# Altium schematic sheet Power1.SchDoc: Titel
size A3; ApprovedBy: name; CompanyName: DCI Electronics bv; DrawnBy: KRS; Address1: Nijverheidsstraat 14; Address2: 4458 AV Eindewege; Address3: Phone: +31 (0)113 344880; DocumentNumber: 6; Revision: 2; SheetNumber: 6; SheetTotal: 14; PageSetup: Record=PageOptions|CenterHorizontal=True|CenterVertical=True|PrintScale=1.00|XCorrection=1.00|YCorrection=1.00|PrintKind=1|BorderSize=5000000|LeftOffset=0|BottomOffset=0|Orientation=2|PaperLength=1000|PaperWidth=1000|Scale=100|PaperSource=7|PrintQuality=-4|MediaType=1|DitherType=10|PaperKind=ISO_A4_(210.00_x_297.00_MM)|PrintScaleMode=1; SubTitle: SubTitel; ApprovedDate: 01-01-12
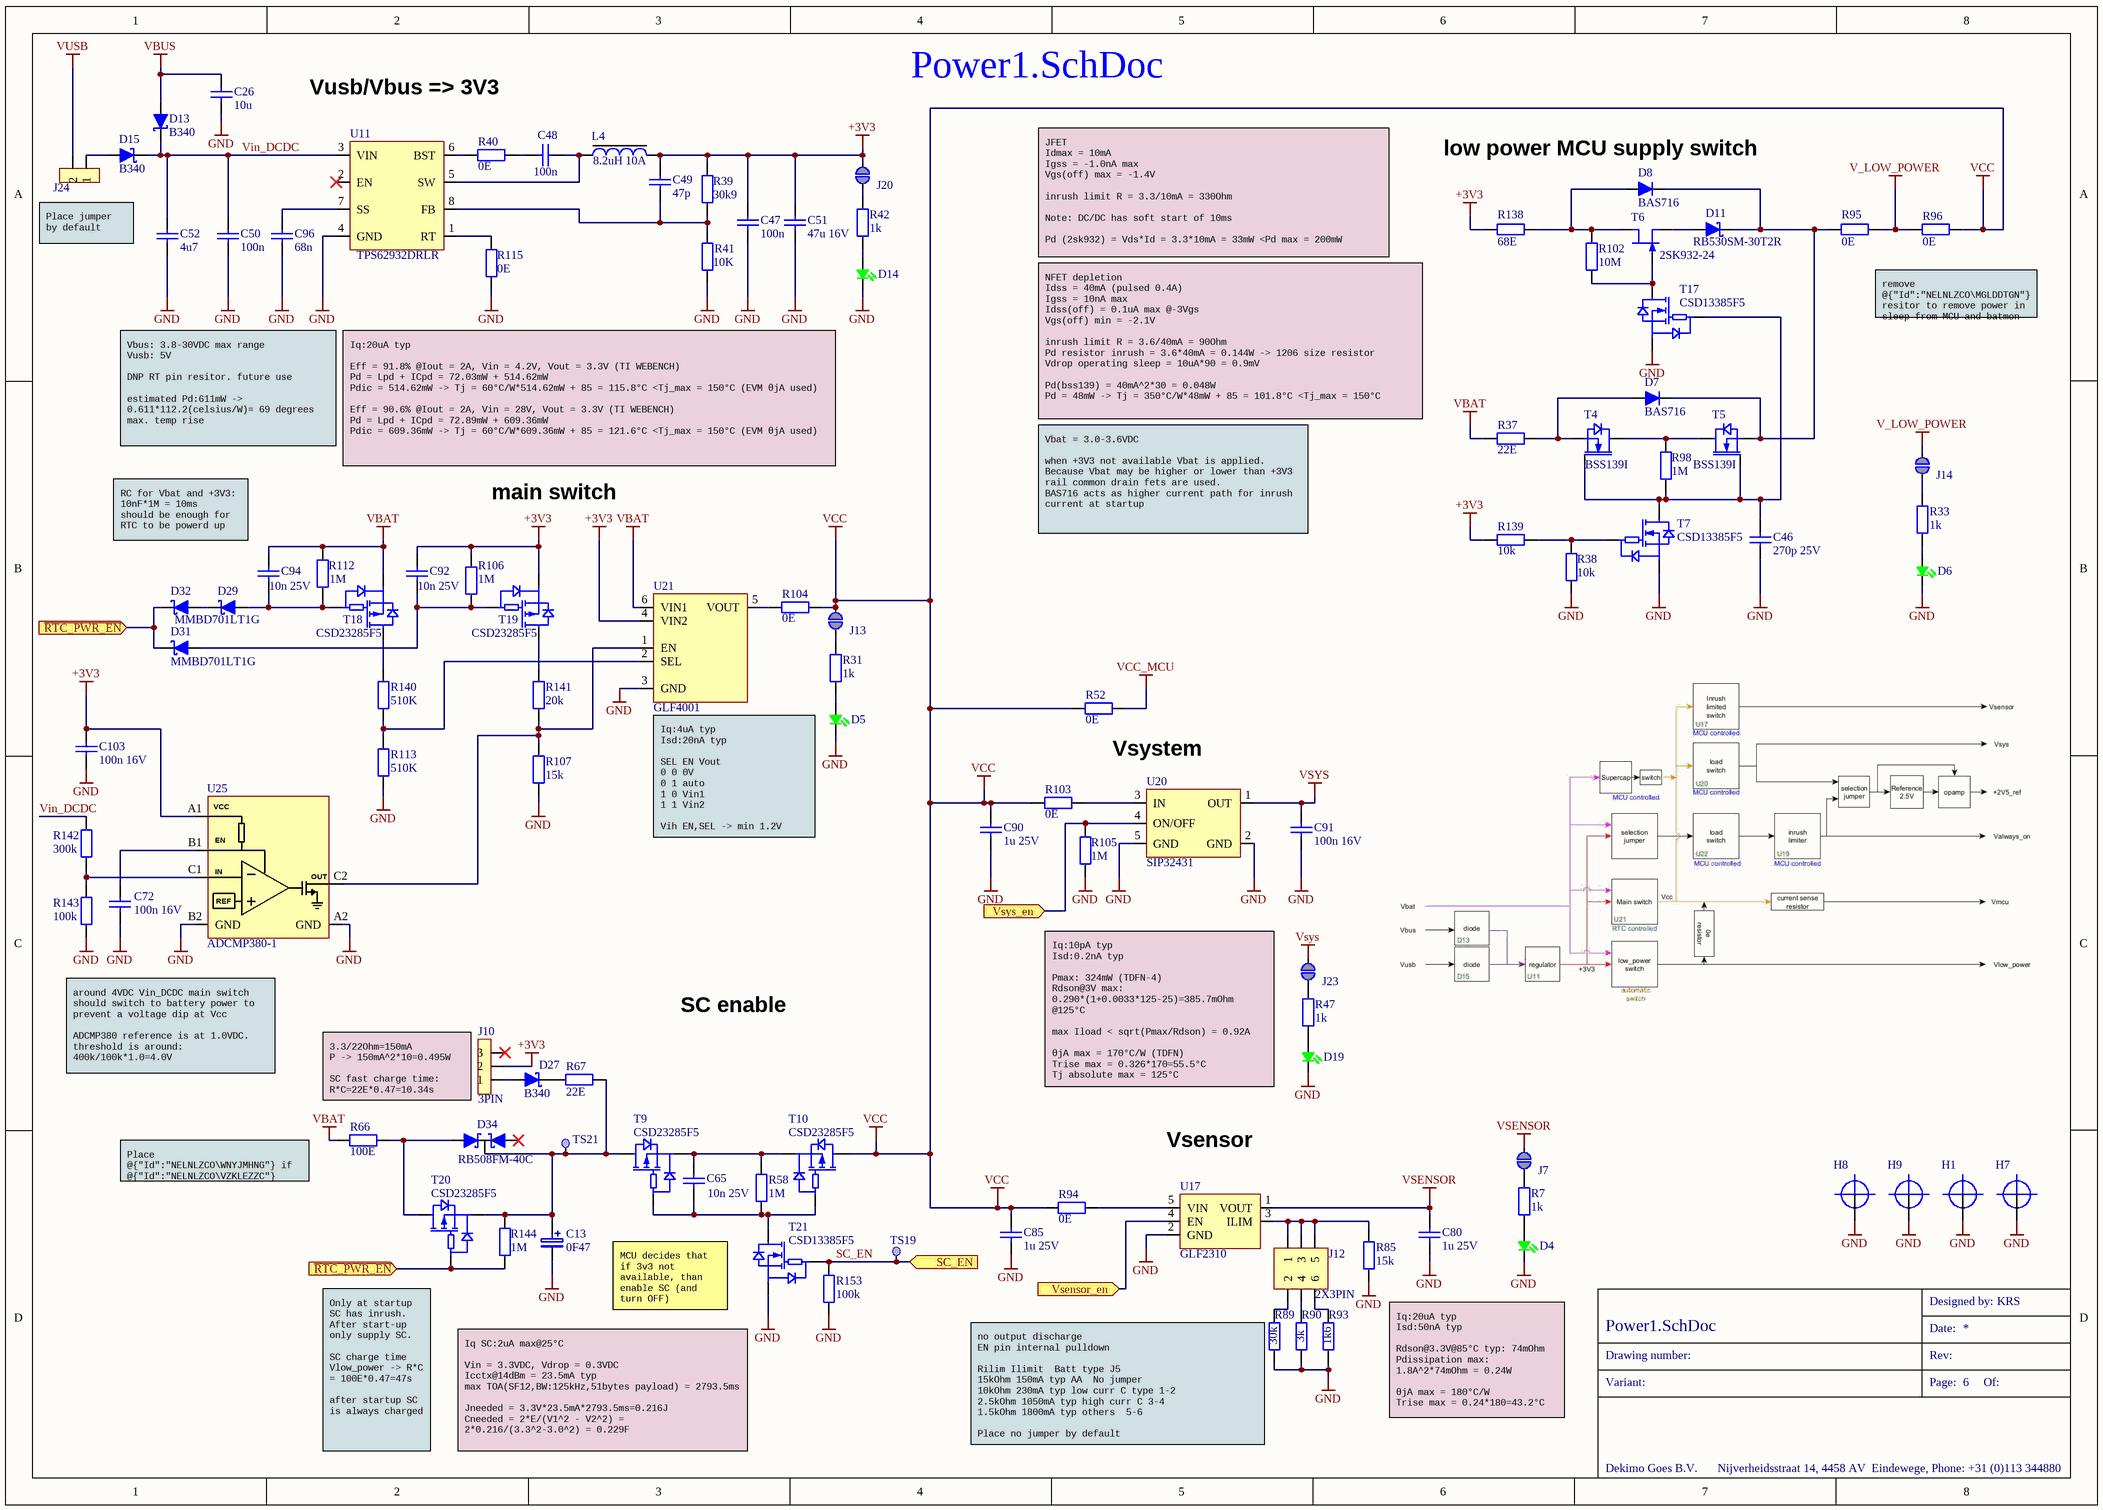
[diagram p0: Power1.SchDoc]

## Parts
C13  0F47  [CAP-003G000-002]
C26  10u  [CAPC3216X18N]
C46  270p 25V  [CAPC1005X05N]
C47  100n  [CAPC1608X09N]
C48  100n  [CAPC1608X09N]
C49  47p  [CAPC1608X09N]
C50  100n  [CAPC1608X09N]
C51  47u 16V  [CAPC3225X27N]
C52  4u7  [CAPC3216X13N]
C65  10n 25V  [CAPC1005X05N]
C72  100n 16V  [CAPC1005X05N]
C80  1u 25V  [CAPC1608X09N]
C85  1u 25V  [CAPC1608X09N]
C90  1u 25V  [CAPC1608X09N]
C91  100n 16V  [CAPC1005X05N]
C92  10n 25V  [CAPC1005X05N]
C94  10n 25V  [CAPC1005X05N]
C96  68n  [CAPC2013X14N]
C103  100n 16V  [CAPC1005X05N]
D4  (no value)  [LED_0603_ANODE]
D5  (no value)  [LED_0603_ANODE]
D6  (no value)  [LED_0603_ANODE]
D7  BAS716  [SODFL16080X62N]
D8  BAS716  [SODFL16080X62N]
D11  RB530SM-30T2R  [SODFL16080X62N]
D13  B340  [DIO-001001-002]
D14  (no value)  [LED_0603_ANODE]
D15  B340  [DIO-001001-002]
D19  (no value)  [LED_0603_ANODE]
D27  B340  [DIO-001001-002]
D29  MMBD701LT1G  [SOT95P245X110-3N]
D31  MMBD701LT1G  [SOT95P245X110-3N]
D32  MMBD701LT1G  [SOT95P245X110-3N]  (value not drawn)
D34  RB508FM-40C  [SOT-650G001-003]
H1  HOLE_PTH  [PTH_0.8_1.5]  (value not drawn)  (no BOM)
H7  HOLE_PTH  [PTH_0.8_1.5]  (value not drawn)  (no BOM)
H8  HOLE_PTH  [PTH_0.8_1.5]  (value not drawn)  (no BOM)
H9  HOLE_PTH  [PTH_0.8_1.5]  (value not drawn)  (no BOM)
J7  Solderbridge - Normally Open  [Solderbridge NO]  (value not drawn)  (no BOM)
J10  3PIN  [CON-003G000-003]
J12  2X3PIN  [CON-003G000-006]
J13  Solderbridge - Normally Open  [Solderbridge NO]  (value not drawn)  (no BOM)
J14  Solderbridge - Normally Open  [Solderbridge NO]  (value not drawn)  (no BOM)
J20  Solderbridge - Normally Open  [Solderbridge NO]  (value not drawn)  (no BOM)
J23  Solderbridge - Normally Open  [Solderbridge NO]  (value not drawn)  (no BOM)
J24  2PIN  [PHDR1X2_P2.54]  (value not drawn)
L4  8.2uH 10A  [IND-001G001-002]
R7  1k  [RESC1608X13N]
R31  1k  [RESC1608X13N]
R33  1k  [RESC1608X13N]
R37  22E  [RESC1608X13N]
R38  10k  [RESC1005X04N]
R39  30k9  [RESC2013X14N]
R40  0E  [RESC1608X13N]
R41  10K  [RESC1608X13N]
R42  1k  [RESC1608X13N]
R47  1k  [RESC1608X13N]
R52  0E  [RESC3116X13N]
R58  1M  [RESC1005x04N]
R66  100E  [RESC3116X13N]
R67  22E  [RESC2013X14N]
R85  15k  [RESC1608X13N]
R89  30k  [RESC1608X13N]
R90  3k  [RESC1608X13N]
R93  1k6  [RESC1608X13N]
R94  0E  [RESC1608X13N]
R95  0E  [RESC3116X13N]
R96  0E  [RESC2013X14N]
R98  1M  [RESC1608X13N]
R102  10M  [RESC1608X13N]
R103  0E  [RESC1608X13N]
R104  0E  [RESC2013X14N]
R105  1M  [RESC1005x04N]
R106  1M  [RESC1005x04N]
R107  15k  [RESC1608X13N]
R112  1M  [RESC1005x04N]
R113  510K  [RESC1005X04N]
R115  0E  [RESC1608X13N]
R138  68E  [RESC2013X14N]
R139  10k  [RESC1005X04N]
R140  510K  [RESC1005X04N]
R141  20k  [RESC1005X04N]
R142  300k  [RESC1005X04N]
R143  100k  [RESC1005X04N]
R144  1M  [RESC1005x04N]
R153  100k  [RESC1005X04N]
T4  BSS139I  [SOT95P245X110_GSD-3N]
T5  BSS139I  [SOT95P245X110_GSD-3N]
T6  2SK932-24  [SOT-950G000-003]
T7  CSD13385F5  [DFN-500G000-003]
T9  CSD23285F5  [DFN-500G000-003]
T10  CSD23285F5  [DFN-500G000-003]
T17  CSD13385F5  [DFN-500G000-003]
T18  CSD23285F5  [DFN-500G000-003]
T19  CSD23285F5  [DFN-500G000-003]
T20  CSD23285F5  [DFN-500G000-003]
T21  CSD13385F5  [DFN-500G000-003]
TS19  TESTPAD  [TESTPAD 2MM]  (value not drawn)  (no BOM)
TS21  TESTPAD  [TESTPAD 2MM]  (value not drawn)  (no BOM)
U11  TPS62932DRLR  [SOT-501001-008]
U17  GLF2310  [SOT95P280X115-5N]
U20  SIP32431  [DFN-500001-004]
U21  GLF4001  [SOT95P300X145-6N]
U25  ADCMP380-1  [BGA-500G001-006]

## Ports
SC_EN (in), Vsensor_en (in), Vsys_en (in), ~{RTC_PWR_EN} (in)

## Nets
+3V3: C47.2 C49.2 C51.2 C92.2 C103.1 J10.2 J20.2 L4.2 R39.2 R106.2 R138.1 R139.2 T19.S U21.4(VIN2) U25.A1(VCC)
GND: C13.- C26.1 C46.1 C47.1 C50.1 C51.1 C52.1 C72.1 C80.1 C85.1 C90.1 C91.1 C96.1 C103.2 D4.C D5.C D6.C D14.C D19.C H1.0 H7.0 H8.0 H9.0 R38.1 R41.1 R85.1 R89.1 R90.1 R93.1 R105.1 R107.1 R113.1 R115.1 R143.1 R153.1 T7.S T17.S T21.S U11.4(GND) U17.2(GND) U20.2(GND) U20.5(GND) U21.3(GND) U25.A2(GND) U25.B2(GND)
V_LOW_POWER: J14.2 R95.2 R96.1
VBAT: C94.2 R37.2 R66.2 R112.2 T18.S U21.6(VIN1)
VBUS: C26.2 D13.A
VCC: C85.2 C90.2 J13.2 R52.2 R94.1 R96.2 R103.1 R104.2 T10.D
VCC_MCU: R52.1
VSENSOR: C80.2 J7.2 U17.1(VOUT)
VSYS: C91.2 J23.2 U20.1(OUT)
VUSB: J24.2
~{RTC_PWR_EN}: D31.C D32.C R144.1 T20.G ; port ~{RTC_PWR_EN}
SC_EN: R153.2 T21.G TS19.1(TP) ; port SC_EN
Vin_DCDC: C50.2 C52.2 D13.C D15.C R142.2 U11.3(VIN)
Vsensor_en: U17.4(EN) ; port Vsensor_en
Vsys_en: R105.2 U20.4(ON/OFF) ; port Vsys_en
NetC13_+: C13.+ D34.C R67.2 R144.2 T9.D T20.S TS21.1(TP)
NetC46_2: C46.2 R98.1 T4.G T5.G T7.D T17.G
NetC48_1: C48.1 L4.1 U11.5(SW)
NetC48_2: C48.2 R40.2
NetC49_1: C49.1 R39.1 R41.2 U11.8(FB)
NetC65_1: C65.1 R58.1 T9.G T10.G T21.D
NetC65_2: C65.2 R58.2 T9.S T10.S
NetC72_2: C72.2 U25.B1(EN)
NetC92_1: C92.1 D31.A R106.1 T19.G
NetC94_1: C94.1 D29.A R112.1 T18.G
NetC96_2: C96.2 U11.7(SS)
NetD4_A: D4.A R7.2
NetD5_A: D5.A R31.2
NetD6_A: D6.A R33.2
NetD7_A: D7.A R37.1 T4.D
NetD7_C: D7.C D8.C D11.C R95.1 T5.D
NetD8_A: D8.A R102.2 R138.2 T6.D
NetD11_A: D11.A T6.S
NetD14_A: D14.A R42.2
NetD15_A: D15.A J24.1
NetD19_A: D19.A R47.2
NetD27_A: D27.A J10.1
NetD27_C: D27.C R67.1
NetD29_C: D29.C D32.A
NetD34_A1: D34.A1 R66.1 T20.D
NetJ7_1: J7.1 R7.1
NetJ12_1: J12.1 J12.3 J12.5 R85.2 U17.3(ILIM)
NetJ12_2: J12.2 R89.2
NetJ12_4: J12.4 R90.2
NetJ12_6: J12.6 R93.2
NetJ13_1: J13.1 R31.1
NetJ14_1: J14.1 R33.1
NetJ20_1: J20.1 R42.1
NetJ23_1: J23.1 R47.1
NetR38_2: R38.2 R139.1 T7.G
NetR40_1: R40.1 U11.6(BST)
NetR94_2: R94.2 U17.5(VIN)
NetR98_2: R98.2 T4.S T5.S
NetR102_1: R102.1 T6.G T17.D
NetR103_2: R103.2 U20.3(IN)
NetR104_1: R104.1 U21.5(VOUT)
NetR107_2: R107.2 R141.1 U21.1(EN) U25.C2(OUT)
NetR113_2: R113.2 R140.1 U21.2(SEL)
NetR115_2: R115.2 U11.1(RT)
NetR140_2: R140.2 T18.D
NetR141_2: R141.2 T19.D
NetR142_1: R142.1 R143.2 U25.C1(IN)

Not connected (* = marked no-connect by the designer): D34 A2*; J10 3*; U11 2(EN)*

## Notes on the sheet
- Vusb/Vbus => 3V3
- (near D8) low power MCU supply switch
- Place jumper
  by default
- JFET
  Idmax = 10mA
  Igss = -1.0nA max
  Vgs(off) max = -1.4V
  inrush limit R = 3.3/10mA = 330Ohm
  Note: DC/DC has soft start of 10ms
  Pd (2sk932) = Vds*Id = 3.3*10mA = 33mW <Pd max = 200mW
- remove @{"Id":"NELNLZCO\MGLDDTGN"} resitor to remove power in sleep from MCU and batmon
- Vbus: 3.8-30VDC max range
  Vusb: 5V
  DNP RT pin resitor. future use
  estimated Pd:611mW -> 0.611*112.2(celsius/W)= 69 degrees max. temp rise
- NFET depletion
  Idss = 40mA (pulsed 0.4A)
  Igss = 10nA max
  Idss(off) = 0.1uA max @-3Vgs
  Vgs(off) min = -2.1V
  inrush limit R = 3.6/40mA = 90Ohm
  Pd resistor inrush = 3.6*40mA = 0.144W -> 1206 size resistor
  Vdrop operating sleep = 10uA*90 = 0.9mV
  Pd(bss139) = 40mA^2*30 = 0.048W
  Pd = 48mW -> Tj = 350°C/W*48mW + 85 = 101.8°C <Tj_max = 150°C
- Iq:20uA typ
  Eff = 91.8% @Iout = 2A, Vin = 4.2V, Vout = 3.3V (TI WEBENCH)
  Pd = Lpd + ICpd = 72.03mW + 514.62mW
  Pdic = 514.62mW -> Tj = 60°C/W*514.62mW + 85 = 115.8°C <Tj_max = 150°C (EVM θjA used)
  Eff = 90.6% @Iout = 2A, Vin = 28V, Vout = 3.3V (TI WEBENCH)
  Pd = Lpd + ICpd = 72.89mW + 609.36mW
  Pdic = 609.36mW -> Tj = 60°C/W*609.36mW + 85 = 121.6°C <Tj_max = 150°C (EVM θjA used)
- main switch
- (near C94) RC for Vbat and +3V3:
  10nF*1M = 10ms
  should be enough for RTC to be powerd up
- Vbat = 3.0-3.6VDC
  when +3V3 not available Vbat is applied. Because Vbat may be higher or lower than +3V3 rail common drain fets are used.
  BAS716 acts as higher current path for inrush current at startup
- Vsystem
- Iq:4uA typ
  Isd:20nA typ
  SEL	EN	Vout
  0	0	0V
  0	1	auto
  1	0	Vin1
  1	1	Vin2
  Vih EN,SEL -> min 1.2V
- SC enable
- around 4VDC Vin_DCDC main switch should switch to battery power to prevent a voltage dip at Vcc
  ADCMP380 reference is at 1.0VDC.
  threshold is around:
  400k/100k*1.0=4.0V
- (near J10) 3.3/22Ohm=150mA
  P -> 150mA^2*10=0.495W
  SC fast charge time:
  R*C=22E*0.47=10.34s
- Iq:10pA typ
  Isd:0.2nA typ
  Pmax: 324mW (TDFN-4)
  Rdson@3V max: 0.290*(1+0.0033*125-25)=385.7mOhm @125°C
  max Iload < sqrt(Pmax/Rdson) = 0.92A
  θjA max = 170°C/W (TDFN)
  Trise max = 0.326*170=55.5°C
  Tj absolute max = 125°C
- (near R66) Place @{"Id":"NELNLZCO\WNYJMHNG"} if @{"Id":"NELNLZCO\VZKLEZZC"} circuit doesn't function
- Vsensor
- MCU decides that if 3v3 not available, than enable SC (and turn OFF)
- (near T20) Only at startup SC has inrush. After start-up only supply SC.
  SC charge time Vlow_power -> R*C = 100E*0.47=47s
  after startup SC is always charged
- Iq SC:2uA max@25°C
  Vin = 3.3VDC, Vdrop = 0.3VDC
  Icctx@14dBm = 23.5mA typ
  max TOA(SF12,BW:125kHz,51bytes payload) = 2793.5ms
  Jneeded = 3.3V*23.5mA*2793.5ms=0.216J
  Cneeded = 2*E/(V1^2 - V2^2) = 2*0.216/(3.3^2-3.0^2) = 0.229F
- (near R89) no output discharge
  EN pin internal pulldown
  Rilim	Ilimit		Batt type	J5
  15kOhm	150mA typ	AA		No jumper
  10kOhm	230mA typ	low curr C type	1-2
  2.5kOhm	1050mA typ	high curr C	3-4
  1.5kOhm	1800mA typ	others		5-6
  Place no jumper by default
- Iq:20uA typ
  Isd:50nA typ
  Rdson@3.3V@85°C typ: 74mOhm
  Pdissipation max: 1.8A^2*74mOhm = 0.24W
  θjA max = 180°C/W
  Trise max = 0.24*180=43.2°C
- Designed by:
- Drawing number:
- Variant:
- Date:
- Page:
- Rev:
- Of:
- Dekimo Goes B.V.
- Nijverheidsstraat 14, 4458 AV  Eindewege, Phone: +31 (0)113 344880
- (in symbol IC ADCMP380-1) REF

## Library data of the parts
C13 = SC 470MV3.9/10: 0F47 3V9 supercap; EngPartGrpMainCode: CAP; ManufactpartCode: PHVL-3R9H474-R-EAT; Type: Capacitor electrol. SMD; Preferred: False; SMD_Flag: True; PartCode: SC 470MV3.9/10
C26 = CKE 10UV50/10: 10uF 50V 20% X5R; EngPartGrpMainCode: CAP; ManufactpartCode: GRM31CR61H106KA12L -MUR; Type: Capacitor ceramic SMD; Preferred: False; SMD_Flag: True; PartCode: CKE 10UV50/10
C46 = CKE 270P/70: 270pF, 25V, 5% COG; EngPartGrpMainCode: CAP; ManufactpartCode: CC0402JRNPO8BN271-YAG; Type: Capacitor ceramic SMD; Preferred: False; SMD_Flag: True; PartCode: CKE 270P/70
C47 C48 C50 = CKE 100N/60: 100nF 50V 10% X7R; EngPartGrpMainCode: CAP; ManufactpartCode: 2238 586 15649-PHI; Type: Capacitor ceramic SMD; Preferred: False; SMD_Flag: True; PartCode: CKE 100N/60
C49 = CKE 47P/60: 47p 50V 5% NP0; EngPartGrpMainCode: CAP; ManufactpartCode: CC0603JRNPO9BN470-YAG; Type: Capacitor ceramic SMD; Preferred: False; SMD_Flag: True; PartCode: CKE 47P/60
C51 = CKE 47UV16/15: 47uF 16V 20% X5R; EngPartGrpMainCode: CAP; ManufactpartCode: EMK325BJ476MM-P-TAI; Type: Capacitor ceramic SMD; Preferred: False; SMD_Flag: True; PartCode: CKE 47UV16/15
C52 = CKE 4U7V50/10: 4.7uF 50V 20% X5R; EngPartGrpMainCode: CAP; ManufactpartCode: C1206C475M5PAC-KEM; Type: Capacitor ceramic SMD; Preferred: False; SMD_Flag: True; PartCode: CKE 4U7V50/10
C65 C92 C94 = CKE 10NV25/70: 10nF, 25V 10%; EngPartGrpMainCode: CAP; ManufactpartCode: 04023C103KAT2A-AVX; Type: Capacitor ceramic SMD; Preferred: False; SMD_Flag: True; PartCode: CKE 10NV25/70
C72 C91 C103 = CKE 100N/70: 100nF, 16V, 10%, X7R; EngPartGrpMainCode: CAP; ManufactpartCode: CC0402KRX7R7BB104-YAG; Type: Capacitor ceramic SMD; Preferred: False; SMD_Flag: True; PartCode: CKE 100N/70
C80 C85 C90 = CKE 1U/61: 1UF, 25V, 10%, 0603, X7R; EngPartGrpMainCode: CAP; ManufactpartCode: CL10B105KA8NNNC-SAM; Type: Capacitor ceramic SMD; Preferred: False; SMD_Flag: True; PartCode: CKE 1U/61
C96 = CKE 68N/11: 68nF 50V 10%; EngPartGrpMainCode: CAP; ManufactpartCode: C0805C683K5RECAUTO-KEM; Type: Capacitor ceramic SMD; Preferred: False; SMD_Flag: True; PartCode: CKE 68N/11
D4-D6 D14 D19 = LED SMDG/16: Led Groen 0603; EngPartGrpMainCode: OPTO; ManufactpartCode: 150060VS75003-WE; Type: LED SMD; Preferred: False; SMD_Flag: True; PartCode: LED SMDG/16
D7 D8 = DIO BAS716: BAS716 85V 200mA; EngPartGrpMainCode: DIO; ManufactpartCode: BAS716,115-NEX; Type: Diode SMD; Preferred: False; SMD_Flag: True; PartCode: DIO BAS716
D11 = DIO RB530SM-30T: 30V 200mA; EngPartGrpMainCode: DIO; ManufactpartCode: RB530SM-30T2R-RO; Type: Diode schottky SMD; Preferred: False; SMD_Flag: True; PartCode: DIO RB530SM-30T
D13 D15 D27 = DIO B340A: 40V, 3A; EngPartGrpMainCode: DIO; ManufactpartCode: B340A-13-F-DIO; Type: Diode schottky SMD; Preferred: False; SMD_Flag: True; PartCode: DIO B340A
D29 D31 D32 = DIO MMBD701LT1G: 70V Low leakage 200nA; EngPartGrpMainCode: DIO; ManufactpartCode: MMBD701LT1G-ONS; Type: Diode schottky SMD; Preferred: False; SMD_Flag: True; PartCode: DIO MMBD701LT1G
D34 = DIO RB508FM-40C: RB508, 40V, 80mA 2 com cat dio; ManufactpartCode: RB508FM-40CFHT106-RO; Type: Diode SMD; Preferred: False; SMD_Flag: True; PartCode: DIO RB508FM-40C; EngPartGrpMainCode: DIO
J7 J13 J14 J20 J23 = SolderbridgeNO: Solderbridge  - Normally Open
J10 = CON PHDR1X3S/11: pinh 1x3/straight/Au/1.27pitch; EngPartGrpMainCode: CONN; ManufactpartCode: M50-3630342-HAR; Preferred: False; SMD_Flag: True; PartCode: CON PHDR1X3S/11; Type: Connector pinhdr SMD
J12 = CON PHDR2X3S/4: 2x3/straight/Au/1.27mm; EngPartGrpMainCode: CONN; ManufactpartCode: 20021121-00006T4LF-AMH; Preferred: False; SMD_Flag: True; PartCode: CON PHDR2X3S/4; Type: Connector pinhdr SMD
J24 = CON PHDR1X2S/1: pinh 1x2/straight/h=5.8/Au; EngPartGrpMainCode: CONN; ManufactpartCode: 0-826629-2-TEC; Preferred: False; PartCode: CON PHDR1X2S/1; Type: Connector Pinheader; SMD_Flag: False
L4 = IND 8U2 10A/1: 8.2uH, 10A 33.4mOhm SMD; EngPartGrpMainCode: IND; ManufactpartCode: SRP1038CC-8R2M-BRN; Type: Inductor choke SMD; Preferred: False; SMD_Flag: True; PartCode: IND 8U2 10A/1
R7 R31 R33 R42 R47 = R 1K/60: 1K, 100mW, 1%; PartCode: R 1K/60; EngPartGrpMainCode: RES; ManufactpartCode: RC0603FR-071KL-YAG; Preferred: True; Type: Resistor metalfilm SMD; SMD_Flag: True
R37 = R 22E/60: 22E 0.1W 1%; EngPartGrpMainCode: RES; ManufactpartCode: RC0603FR-0722RL-YAG; Preferred: True; PartCode: R 22E/60; Type: Resistor metalfilm SMD; SMD_Flag: True
R38 R139 = R 10K/70: 10K, 62.5mW, 1%; EngPartGrpMainCode: RES; ManufactpartCode: RC0402FR-0710KL-YAG; Preferred: False; SMD_Flag: True; PartCode: R 10K/70; Type: Resistor metalfilm SMD
R39 = R 30K9/11: 30k9 0.1W 1%; EngPartGrpMainCode: RES; ManufactpartCode: RC0805FR-0730K9L-YAG; Preferred: False; SMD_Flag: True; PartCode: R 30K9/11; Type: Resistor metalfilm SMD
R40 R94 R103 R115 = R 0E/60: 0E 100mW, 1%; PartCode: R 0E/60; EngPartGrpMainCode: RES; ManufactpartCode: RC0603FR-070RL-YAG; Preferred: True; Type: Resistor metalfilm SMD; SMD_Flag: True
R41 = R 10K/60: 10k 100mW, 1%; EngPartGrpMainCode: RES; ManufactpartCode: RC0603FR-0710KL-YAG; Preferred: True; PartCode: R 10K/60; Type: Resistor metalfilm SMD; SMD_Flag: True
R52 R95 = R 0E/10: PartCode: R 0E/10; EngPartGrpMainCode: RES; ManufactpartCode: RC1206FR-070RL-YAG; Preferred: True; Type: Resistor metalfilm SMD; SMD_Flag: True
R58 R105 R106 R112 R144 = R 1M/70: 1M, 62.5mW, 1%; PartCode: R 1M/70; EngPartGrpMainCode: RES; ManufactpartCode: RC0402FR-071ML-YAG; Preferred: False; SMD_Flag: True; Type: Resistor metalfilm SMD
R66 = R 100E/10: 100E 0.25W 1%; EngPartGrpMainCode: RES; ManufactpartCode: RC1206FR-07100RL-YAG; Preferred: True; PartCode: R 100E/10; Type: Resistor metalfilm SMD; SMD_Flag: True
R67 = R 22E/17: 22E 0.5W 5%; EngPartGrpMainCode: RES; ManufactpartCode: SG73P2ATTD220G-KOA; Preferred: False; SMD_Flag: True; PartCode: R 22E/17; Type: Resistor metalfilm SMD
R85 R107 = R 15K/60: 15k 100mW 1%; EngPartGrpMainCode: RES; ManufactpartCode: RC0603FR-0715KL-YAG; Preferred: False; SMD_Flag: True; PartCode: R 15K/60; Type: Resistor metalfilm SMD
R89 = R 30K/60: 30k 100mW, 1%; EngPartGrpMainCode: RES; ManufactpartCode: RC0603FR-0730KL-YAG; Preferred: False; SMD_Flag: True; PartCode: R 30K/60; Type: Resistor metalfilm SMD
R90 = R 3K/60: 3k 0.1W 1%; PartCode: R 3K/60; EngPartGrpMainCode: RES; ManufactpartCode: RC0603FR-073KL-YAG; Preferred: False; SMD_Flag: True; Type: Resistor metalfilm SMD
R93 = R 1K6/60: 1.6k 100mW 1%; EngPartGrpMainCode: RES; ManufactpartCode: RC0603FR-071K6L-YAG; Preferred: False; SMD_Flag: True; PartCode: R 1K6/60; Type: Resistor metalfilm SMD
R96 R104 = R 0E/11: 0E 0.125W 5%; PartCode: R 0E/11; EngPartGrpMainCode: RES; ManufactpartCode: RC0805JR-070RL-YAG; Preferred: True; Type: Resistor metalfilm SMD; SMD_Flag: True
R98 = R 1M/60: 1M 0.1W 1%; PartCode: R 1M/60; EngPartGrpMainCode: RES; ManufactpartCode: RC0603FR-071ML-YAG; Preferred: False; SMD_Flag: True; Type: Resistor metalfilm SMD
R102 = R 10M/60: 10M 0.1W 1%; EngPartGrpMainCode: RES; ManufactpartCode: RC0603FR-0710ML-YAG; Preferred: False; SMD_Flag: True; PartCode: R 10M/60; Type: Resistor metalfilm SMD
R113 R140 = R 510K/70: 510K 62.5mW 1%; EngPartGrpMainCode: RES; ManufactpartCode: RC0402FR-10510KL-YAG; Preferred: False; SMD_Flag: True; PartCode: R 510K/70; Type: Resistor metalfilm SMD
R138 = R 68E/11: 68E  0.125W 1%; EngPartGrpMainCode: RES; ManufactpartCode: CRG0805F68R TYC; Preferred: False; SMD_Flag: True; PartCode: R 68E/11; Type: Resistor metalfilm SMD
R141 = R 20K/70: 20K 1% 0.1W; EngPartGrpMainCode: RES; ManufactpartCode: RC0402FR-0720KP-YAG; Preferred: False; SMD_Flag: True; PartCode: R 20K/70; Type: Resistor metalfilm SMD
R142 = R 300K/70: 300K, 62.5mW, 1%; EngPartGrpMainCode: RES; ManufactpartCode: RC0402FR-07300KL-YAG; Preferred: False; SMD_Flag: True; PartCode: R 300K/70; Type: Resistor metalfilm SMD
R143 R153 = R 100K/70: 100K, 62.5mW, 1%; EngPartGrpMainCode: RES; ManufactpartCode: RC0402FR-07100KL-YAG; Preferred: False; SMD_Flag: True; PartCode: R 100K/70; Type: Resistor metalfilm SMD
T4 T5 = TRA BSS139I: 30mA, 250V, 30Rds; EngPartGrpMainCode: TRAN; ManufactpartCode: BSS139IXTSA1-INF; Type: FET N-channel SMD; Preferred: False; SMD_Flag: True; PartCode: TRA BSS139I
T6 = TRA 2SK932-24: 50mA, 15V, JFET N-channel; EngPartGrpMainCode: TRAN; ManufactpartCode: 2SK932-24-TB-E-ONS; Type: FET N-channel SMD; Preferred: False; SMD_Flag: True; PartCode: TRA 2SK932-24
T7 T17 T21 = TRA CSD13385F5: 7.1A, 12V, N-channel FemtoFet; EngPartGrpMainCode: TRAN; ManufactpartCode: CSD13385F5-TI; Type: FET N-channel SMD; Preferred: False; SMD_Flag: True; PartCode: TRA CSD13385F5
T9 T10 T18-T20 = TRA CSD23285F5: 3.3A, 12V, P-channel FemtoFet; EngPartGrpMainCode: TRAN; ManufactpartCode: CSD23285F5-TI; Type: FET P-channel SMD; Preferred: False; SMD_Flag: True; PartCode: TRA CSD23285F5
TS19 TS21 = TESTPAD-2.0: 0.5mm Testpad SMD; PartCode: TESTPAD-2.0
U11 = IC TPS62932: Buck 3.8-30V to 0.2-22V 2A; EngPartGrpMainCode: IC; ManufactpartCode: TPS62932DRLR-TI; Preferred: False; SMD_Flag: True; PartCode: IC TPS62932; Type: IC regulator SMD
U17 = IC GLF2310A-T1: load sw adj current limit 5.5V; EngPartGrpMainCode: IC; ManufactpartCode: GLF2310A-T1G7-GLF; Preferred: False; SMD_Flag: True; PartCode: IC GLF2310A-T1; Type: IC switch SMD
U20 = IC SIP32431DN: load sw, 5.5V, 10pA Ishutdown; EngPartGrpMainCode: IC; ManufactpartCode: SIP32431DNP3-T1GE4-VIS; Preferred: False; SMD_Flag: True; PartCode: IC SIP32431DN; Type: IC switch SMD
U21 = IC GLF4001: Power mulitplexer, 5.5V, 2A; EngPartGrpMainCode: IC; ManufactpartCode: GLF4001-GLF; Preferred: False; SMD_Flag: True; PartCode: IC GLF4001; Type: IC switch SMD
U25 = IC ADCMP380-1: LM293 dual comparator; EngPartGrpMainCode: IC; ManufactpartCode: ADCMP380-1ACBZ-RL7-AD; Preferred: False; SMD_Flag: True; PartCode: IC ADCMP380-1; Type: IC comparator SMD